# EAGLE design LTC2942-1 (EAGLE 9.6.2)
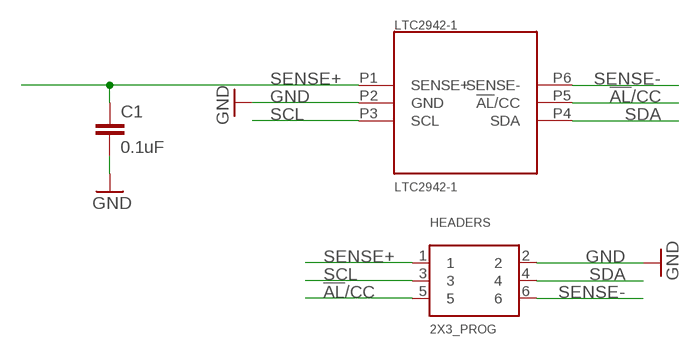
[diagram p0: schematic, sheet 1]

## Parts
C1  0.1uF  CAP  [0805]
HEADERS  2X3_PROG  [2X3_0.1IN]
LTC2942-1  LTC2942-1  [LTC2942-1]

## Nets
!AL!/CC: HEADERS.5 LTC2942-1.P5(!AL!/CC)
GND: C1.2 HEADERS.2 LTC2942-1.P2(GND)
SCL: HEADERS.3 LTC2942-1.P3(SCL)
SDA: HEADERS.4 LTC2942-1.P4(SDA)
SENSE+: C1.1 HEADERS.1 LTC2942-1.P1(SENSE+)
SENSE-: HEADERS.6 LTC2942-1.P6(SENSE-)

## Library data of the parts
C1 = Ilya_Teach:CAP
HEADERS = Ilya_Teach:2X3_PROG
LTC2942-1 = LTC2942-1:LTC2942-1

## Board
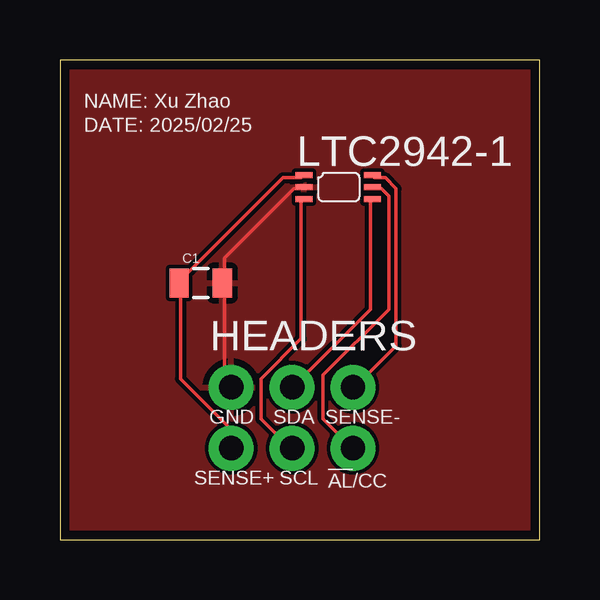
[diagram p1: board, top side]

Size 20 x 20 mm. Coordinates in mm from the lower left corner, seen from the top.
Outline: 0,0 20,0 20,20 0,20 0,0
Copper layers (1*16): Top 0.0356mm / dielectric 1.5011mm / Bottom 0.0356mm
Design rules "LaenPCBOrder": minimum track width 6mil, minimum drill 13mil, track to track 6mil, track to pad 6mil, pad to pad 6mil, via to via 6mil, smd to smd 6mil, copper to edge 15mil, drill to drill 6mil, minimum pad ring 7mil, minimum via ring 7mil, stop-mask expansion 3mil, vias tented up to drill 0mil, thermal gap 10mil

### Footprints (pad centres in the part's own frame; a part is rotated, then mirrored left to right if it is on the bottom)
0805 = smd 0.8 x 1.2: 1 -0.9,0; 2 0.9,0
2X3_0.1IN = drill 1.016 pad 1.88: 1 -2.54,-1.27; 2 -2.54,1.27; 3 0,-1.27; 4 0,1.27; 5 2.54,-1.27; 6 2.54,1.27
LTC2942-1 = smd 0.7 x 0.25: P1 -1.5,0.5; P2 -1.5,0; P3 -1.5,-0.5; P4 1.35,-0.5; P5 1.35,0; P6 1.35,0.5

### Placement (x,y rotation side)
C1  5.87,10.7 0 top
HEADERS  9.68,5.08 0 top
LTC2942-1  11.68,14.7 0 top

### Tracks (layer width: path | path; a pad name or v marks a point on that pad's centre or on a via)
!AL!/CC
  Top 0.152: LTC2942-1.P5 13.11,14.63 13.41,14.63 13.72,14.33 13.72,9.6 10.97,6.86 10.97,5.03 12.19,3.81 HEADERS.5
GND
  Top 0.152: LTC2942-1.P2 10.06,14.63 9.75,14.63 6.86,11.73 6.86,10.82 C1.2 6.86,10.67 6.86,6.55 7.01,6.4 HEADERS.2
  pour Top: 0,20 0,0 20,0 20,20
SCL
  Top 0.152: LTC2942-1.P3 10.06,14.17 10.06,8.38 8.38,6.71 8.38,5.03 9.6,3.81 HEADERS.3
SDA
  Top 0.152: LTC2942-1.P4 12.95,14.17 12.95,9.6 9.75,6.4 HEADERS.4
SENSE+
  Top 0.152: LTC2942-1.P1 10.06,15.09 9.3,15.09 5.03,10.82 C1.1 5.03,10.67 5.03,6.71 7.01,4.72 7.01,3.81 HEADERS.1
SENSE-
  Top 0.152: LTC2942-1.P6 13.11,15.09 13.56,15.09 14.02,14.63 14.02,8.08 12.34,6.4 HEADERS.6

### Text on the board
tPlace: NAME: Xu Zhao | DATE: 2025/02/25 | GND | SDA | SENSE- | SENSE+ | SCL | !AL!/CC